# Altium schematic sheet Sheet1.SchDoc
size A
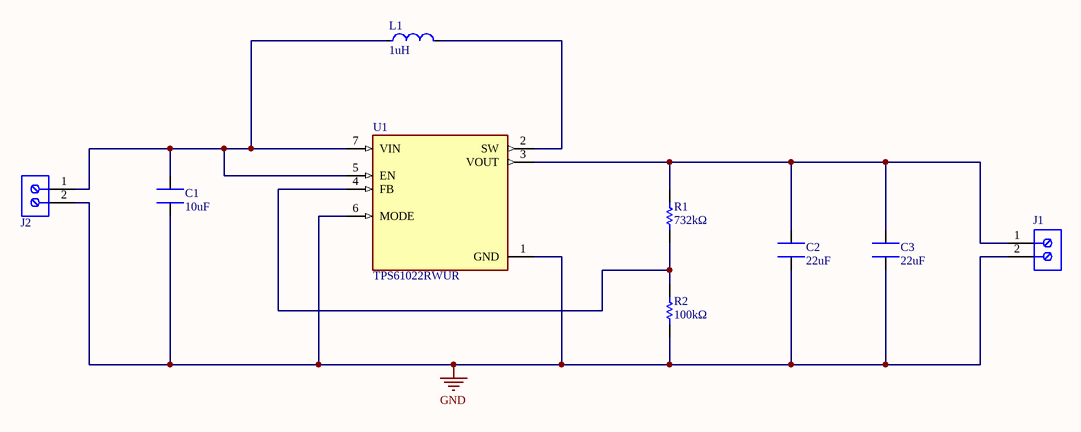
[diagram p0: Sheet1.SchDoc]

## Parts
C1  10uF  [CL21A106KPFNNNE]
C2  22uF  [CL21A226KOQNNNE]
C3  22uF  [CL21A226KOQNNNE]
J1  691709710302  [WURTH_691709710302]  (value not drawn)
J2  691709710302  [WURTH_691709710302]  (value not drawn)
L1  1uH  [SPM10054T-1R0M-HZ]
R1  732kΩ  [0805W8F7323T5E]
R2  100kΩ  [CRCW0402100KFKED]
U1  TPS61022RWUR  [TPS61022RWUR]

## Nets
GND: C1.1 C2.2 C3.2 J1.2 J2.2 R2.1 U1.1(GND) U1.6(MODE)
NetC1_2: C1.2 J2.1 L1.1 U1.5(EN) U1.7(VIN)
NetC2_1: C2.1 C3.1 J1.1 R1.2 U1.3(VOUT)
NetL1_2: L1.2 U1.2(SW)
NetR1_1: R1.1 R2.2 U1.4(FB)

## Library data of the parts
C1 = CL21A106KPFNNNE: 10V 10uF X5R ±10% 0805 Multilayer Ceramic Capacitors MLCC - SMD/SMT ROHS /; Manufacturer 1: Samsung; Supplier 1: Avnet; Manufacturer Part Number 1: CL21A106KPFNNNE; Stock 1: 1410000; Pricing 1: 2000=0.00911, 4000=0.00898, 8000=0.00872, 12000=0.00853, 16000=0.00820 (USD); RoHS: Yes; Mount: Surface Mount; Case/Package: 0805; Case Code (Metric): 2012; Case Code (Imperial): 0805; Contact Plating: Tin; Min Operating Temperature: -55°C; Max Operating Temperature: 85°C; Capacitance: 10uF; Tolerance: 10%; Voltage Rating: 10V; Packaging: Tape and Reel; Package Quantity: 1; Dielectric: X5R; Voltage Rating (DC): 10V; Series: CL; Construction: Flat; Length: 2mm; Width: 0.049inch; Height: 1.25mm; Thickness: 0.053inch; Depth: 1.25mm; Radiation Hardening: No; Lead Free: Lead Free; RoHS Compliant: Yes; ComponentLink1URL: https://datasheet.ciiva.com/16199/cl05b104kq5nnnc-16199024.pdf?src-supplier=Future+Electronics; ComponentLink1Description: https://datasheet.ciiva.com/16199/cl05b104kq5nnnc-16199024.pdf?src-supplier=Future+Electronics; ComponentLink2URL: https://datasheet.ciiva.com/15195/getdatasheetpartid-357423-15195857.pdf?src-supplier=Verical; ComponentLink2Description: https://datasheet.ciiva.com/15195/getdatasheetpartid-357423-15195857.pdf?src-supplier=Verical; Supplier Part Number 1: CL21A106KPFNNNE
C2 C3 = CL21A226KOQNNNE: 16V 22uF X5R ±10% 0805 Multilayer Ceramic Capacitors MLCC - SMD/SMT ROHS /; Manufacturer 1: Samsung; Supplier 1: Digi-Key; Manufacturer Part Number 1: CL21A226KOQNNNE; Stock 1: 161924; Pricing 1: 1=0.35000, 10=0.24600, 50=0.17240, 100=0.14780, 500=0.11088, 1000=0.09363 (USD); RoHS: Yes; Mount: Surface Mount; Case/Package: 0805; Case Code (Metric): 2012; Case Code (Imperial): 0805; Min Operating Temperature: -55°C; Max Operating Temperature: 85°C; Packaging: Tape and Reel; Capacitance: 22uF; Voltage Rating: 16V; Tolerance: 10%; Voltage Rating (DC): 16V; Length: 0.079inch; Width: 0.049inch; Thickness: 0.055inch; Lead Free: Lead Free; RoHS Compliant: Yes; ComponentLink1URL: http://www.samsungsem.com/kr/support/library/product-catalog/mlcc.jsp?src-supplier=Digi-Key; ComponentLink1Description: http://www.samsungsem.com/kr/support/library/product-catalog/mlcc.jsp?src-supplier=Digi-Key; Supplier Part Number 1: 1276-6526-1-ND
J1 J2 = 691709710302: Conn Terminal Block F 2 POS 5mm Solder RA SMD 6A T/R; Manufacturer 1: Wurth Electronics Midcom; Plating: Steel; Voltage Rating: 300V; Number of Levels: 1; Number of Positions Per Level: 2; Connector Type: Screw; Wire Gauge (Max): 30AWG; Wire Gauge (Min): 14AWG; Pitch: 0.197inch; Supplier 1: RSComponents; Manufacturer Part Number 1: 691709710302; Stock 1: 201; Pricing 1: 10=1.89000, 25=1.80000, 50=1.71000, 100=1.67000 (GBP); RoHS: Yes; Mount: Surface Mount; Color: Black; Contact Plating: Tin; Housing Material: Nylon; Min Operating Temperature: -40°C; Max Operating Temperature: 115°C; Package Quantity: 1; Packaging: Tape and Reel; Current Rating: 6A; Current: 6A; Voltage: 300V; Termination: Screw; Number of Positions: 2; Number of Contacts: 2; Wire/Cable Gauge: 30AWG; REACH SVHC: Unknown; Flammability Rating: UL94 V-0; RoHS Compliant: Yes; ComponentLink1URL: http://www.mouser.com/ds/2/445/6917097103xx-271684.pdf?src-supplier=Mouser; ComponentLink1Description: http://www.mouser.com/ds/2/445/6917097103xx-271684.pdf?src-supplier=Mouser; ComponentLink2URL: http://katalog.we-online.de/em/datasheet/6917097103xx.pdf?src-supplier=Digi-Key; ComponentLink2Description: http://katalog.we-online.de/em/datasheet/6917097103xx.pdf?src-supplier=Digi-Key; ComponentLink3URL: https://katalog.we-online.de/em/datasheet/6917097103xx.pdf?src-supplier=Digi-Key; ComponentLink3Description: https://katalog.we-online.de/em/datasheet/6917097103xx.pdf?src-supplier=Digi-Key; ComponentLink4URL: http://www.farnell.com/cad/1804164.pdf?src-supplier=Element14; ComponentLink4Description: http://www.farnell.com/cad/1804164.pdf?src-supplier=Element14; Supplier Part Number 1: 1622155P
L1 = SPM10054T-1R0M-HZ: 27.5A 1uH ±20% 24A 2.4mΩ - Inductors (SMD) ROHS; Manufacturer 1: TDK; Supplier 1: Arrow Electronics; Manufacturer Part Number 1: SPM10054T-1R0M-HZ; Stock 1: 500; Pricing 1: 1=2.67660, 10=2.38130, 25=1.96820, 100=1.66410, 250=1.53290, 500=1.32980 (USD); RoHS: Yes; RoHS Compliant: Yes; ComponentLink1URL: https://product.tdk.com/info/en/catalog/datasheets/inductor_automotive_power_spm10054-hz_en.pdf?src-supplier=Digi-Key; ComponentLink1Description: https://product.tdk.com/info/en/catalog/datasheets/inductor_automotive_power_spm10054-hz_en.pdf?src-supplier=Digi-Key; Supplier Part Number 1: SPM10054T-1R0M-HZ
R1 = 0805W8F7323T5E: ±1% 125mW Thick Film Resistors 150V ±100ppm/℃ -55℃~+155℃ 732kΩ 0805 Chip Resistor - Surface Mount ROHS; Manufacturer: UNI-ROYAL(Uniroyal Elec); Category: Chip Resistor - Surface Mount ROHS; Manufacturer Part Number: 0805W8F7323T5E
R2 = CRCW0402100KFKED: / ±1% 63mW 75V ±100ppm/K 100kΩ -55℃~+155℃ 0402 Chip Resistor - Surface Mount ROHS; Manufacturer 1: Vishay; Resistance: 100kR; Temperature Coefficient: 100ppm/°C; Voltage Rating: 50V; Supplier 1: Future Electronics; Manufacturer Part Number 1: CRCW0402100KFKED; Stock 1: 6000; Pricing 1: 10000=0.01080, 20000=0.01080, 30000=0.01080, 50000=0.01080, 100000=0.01080 (USD); RoHS: Yes; Mount: Surface Mount; Case/Package: 0402; Number of Pins: 2; Contact Plating: Tin; Weight: 2.3E-05oz; Case Code (Metric): 1005; Case Code (Imperial): 0402; Size Code: 0402; Min Operating Temperature: -55°C; Max Operating Temperature: 155°C; Tolerance: 1%; Resistor Type: Thick Film; Power Rating: 63mW; Termination: SMD/SMT; Packaging: Tape and Reel; Package Quantity: 10000; Number of Terminations: 2; Max Power Dissipation: 63mW; Voltage Rating (DC): 50V; Features: Automotive AEC-Q200; Series: CRCW; Technology: THICK FILM; Resistance Tolerance: 1%; Construction: Rectangular; Length: 1mm; Width: 0.02inch; Height: 0.35mm; Depth: 0.5mm; Radiation Hardening: No; Lead Free: Lead Free; RoHS Compliant: Yes; REACH SVHC: Unknown; Military Standard: Not; ComponentLink1URL: https://datasheet.ciiva.com/11810/0900766b80d98824-11810752.pdf?src-supplier=RSComponents; ComponentLink1Description: https://datasheet.ciiva.com/11810/0900766b80d98824-11810752.pdf?src-supplier=RSComponents; ComponentLink2URL: https://datasheet.ciiva.com/46441/1720486-46441598.pdf?src-supplier=Element14; ComponentLink2Description: https://datasheet.ciiva.com/46441/1720486-46441598.pdf?src-supplier=Element14; ComponentLink3URL: https://datasheet.ciiva.com/26316/fld-crcw-e3-data-en-26316630.pdf?src-supplier=Distrelec; ComponentLink3Description: https://datasheet.ciiva.com/26316/fld-crcw-e3-data-en-26316630.pdf?src-supplier=Distrelec; ComponentLink4URL: https://datasheet.ciiva.com/2463/dcrcwe3-2463065.pdf?src-supplier=Digi-Key; ComponentLink4Description: https://datasheet.ciiva.com/2463/dcrcwe3-2463065.pdf?src-supplier=Digi-Key; ComponentLink5URL: https://datasheet.ciiva.com/2463/dcrcwe3-2463066.pdf?src-supplier=Digi-Key; ComponentLink5Description: https://datasheet.ciiva.com/2463/dcrcwe3-2463066.pdf?src-supplier=Digi-Key; ComponentLink6URL: https://datasheet.ciiva.com/2463/dcrcwe3-2463064.pdf?src-supplier=Digi-Key; ComponentLink6Description: https://datasheet.ciiva.com/2463/dcrcwe3-2463064.pdf?src-supplier=Digi-Key; ComponentLink7URL: https://datasheet.ciiva.com/16776/70201119-16776281.pdf?src-supplier=Allied+Electronics; ComponentLink7Description: https://datasheet.ciiva.com/16776/70201119-16776281.pdf?src-supplier=Allied+Electronics; ComponentLink8URL: https://datasheet.ciiva.com/5546/dcrcwe3-109170-5546638.pdf?src-supplier=Mouser; ComponentLink8Description: https://datasheet.ciiva.com/5546/dcrcwe3-109170-5546638.pdf?src-supplier=Mouser; ComponentLink9URL: https://datasheet.ciiva.com/3255/dcrcwe3-3255948.pdf?src-supplier=Avnet; ComponentLink9Description: https://datasheet.ciiva.com/3255/dcrcwe3-3255948.pdf?src-supplier=Avnet; ComponentLink10URL: https://datasheet.ciiva.com/16208/dcrcwe3-16208508.pdf?src-supplier=Future+Electronics; ComponentLink10Description: https://datasheet.ciiva.com/16208/dcrcwe3-16208508.pdf?src-supplier=Future+Electronics; ComponentLink11URL: https://datasheet.ciiva.com/16941/dcrcwe3-16941129.pdf?src-supplier=Avnet+Europe; ComponentLink11Description: https://datasheet.ciiva.com/16941/dcrcwe3-16941129.pdf?src-supplier=Avnet+Europe; ComponentLink12URL: https://datasheet.ciiva.com/3255/dcrcwe3-3255947.pdf?src-supplier=Avnet; ComponentLink12Description: https://datasheet.ciiva.com/3255/dcrcwe3-3255947.pdf?src-supplier=Avnet
U1 = TPS61022RWUR: 8-A boost converter with 0.5-V ultra-low input voltage 7-VQFN-HR -40 to 125; Manufacturer 1: Texas Instruments; Supplier 1: Mouser; Manufacturer Part Number 1: TPS61022RWUR; Stock 1: 0; Pricing 1: 1=1.87000, 10=1.69000, 50=1.60000, 100=1.36000, 1000=0.92500, 10000=0.92400 (USD); RoHS: Yes; Supplier Part Number 1: 595-TPS61022RWUR